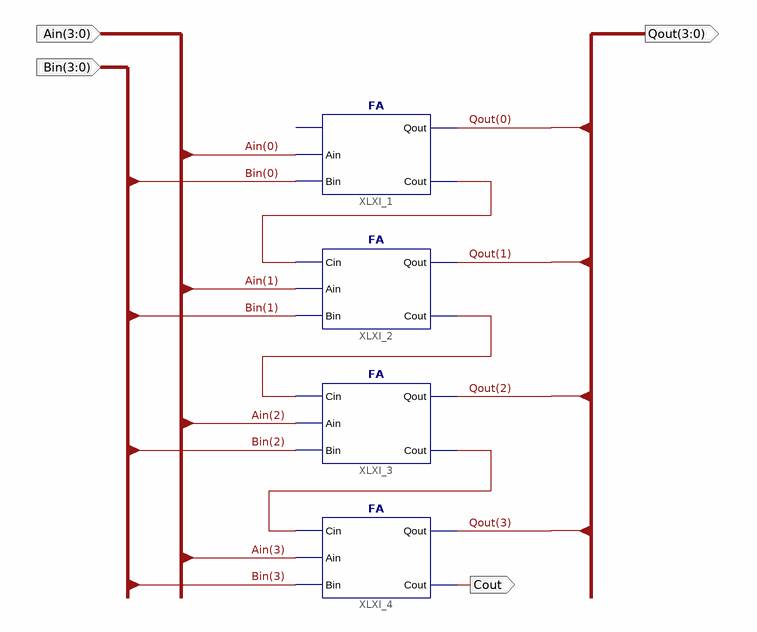
[diagram p0: schematic sheet 1]
// Xilinx ISE schematic FA4b.sch (spartan3e) as structural Verilog: 4 symbols, 4 ports
module FA4b (
  input  [3:0] Ain,
  input  [3:0] Bin,
  output Cout,
  output [3:0] Qout
);

  wire XLXN_1, XLXN_2, XLXN_3;

  FA XLXI_1 (.Ain(Ain[0]), .Bin(Bin[0]), .Qout(Qout[0]), .Cout(XLXN_1));  // open: Cin
  FA XLXI_2 (.Cin(XLXN_1), .Ain(Ain[1]), .Bin(Bin[1]), .Qout(Qout[1]), .Cout(XLXN_2));
  FA XLXI_3 (.Cin(XLXN_2), .Ain(Ain[2]), .Bin(Bin[2]), .Qout(Qout[2]), .Cout(XLXN_3));
  FA XLXI_4 (.Cin(XLXN_3), .Ain(Ain[3]), .Bin(Bin[3]), .Qout(Qout[3]), .Cout(Cout));
endmodule
